# EasyEDA Pro project Lanyard.epro

# Schematic Schematic1
Board Name: Board1; Create Date: 2026-06-07; Page Name: P1; Project Name: lanyard; Schematic Name: Schematic1; Update Date: 2026-06-13; Company: EasyEDA.com; Page Size: A4; Version: V1.0
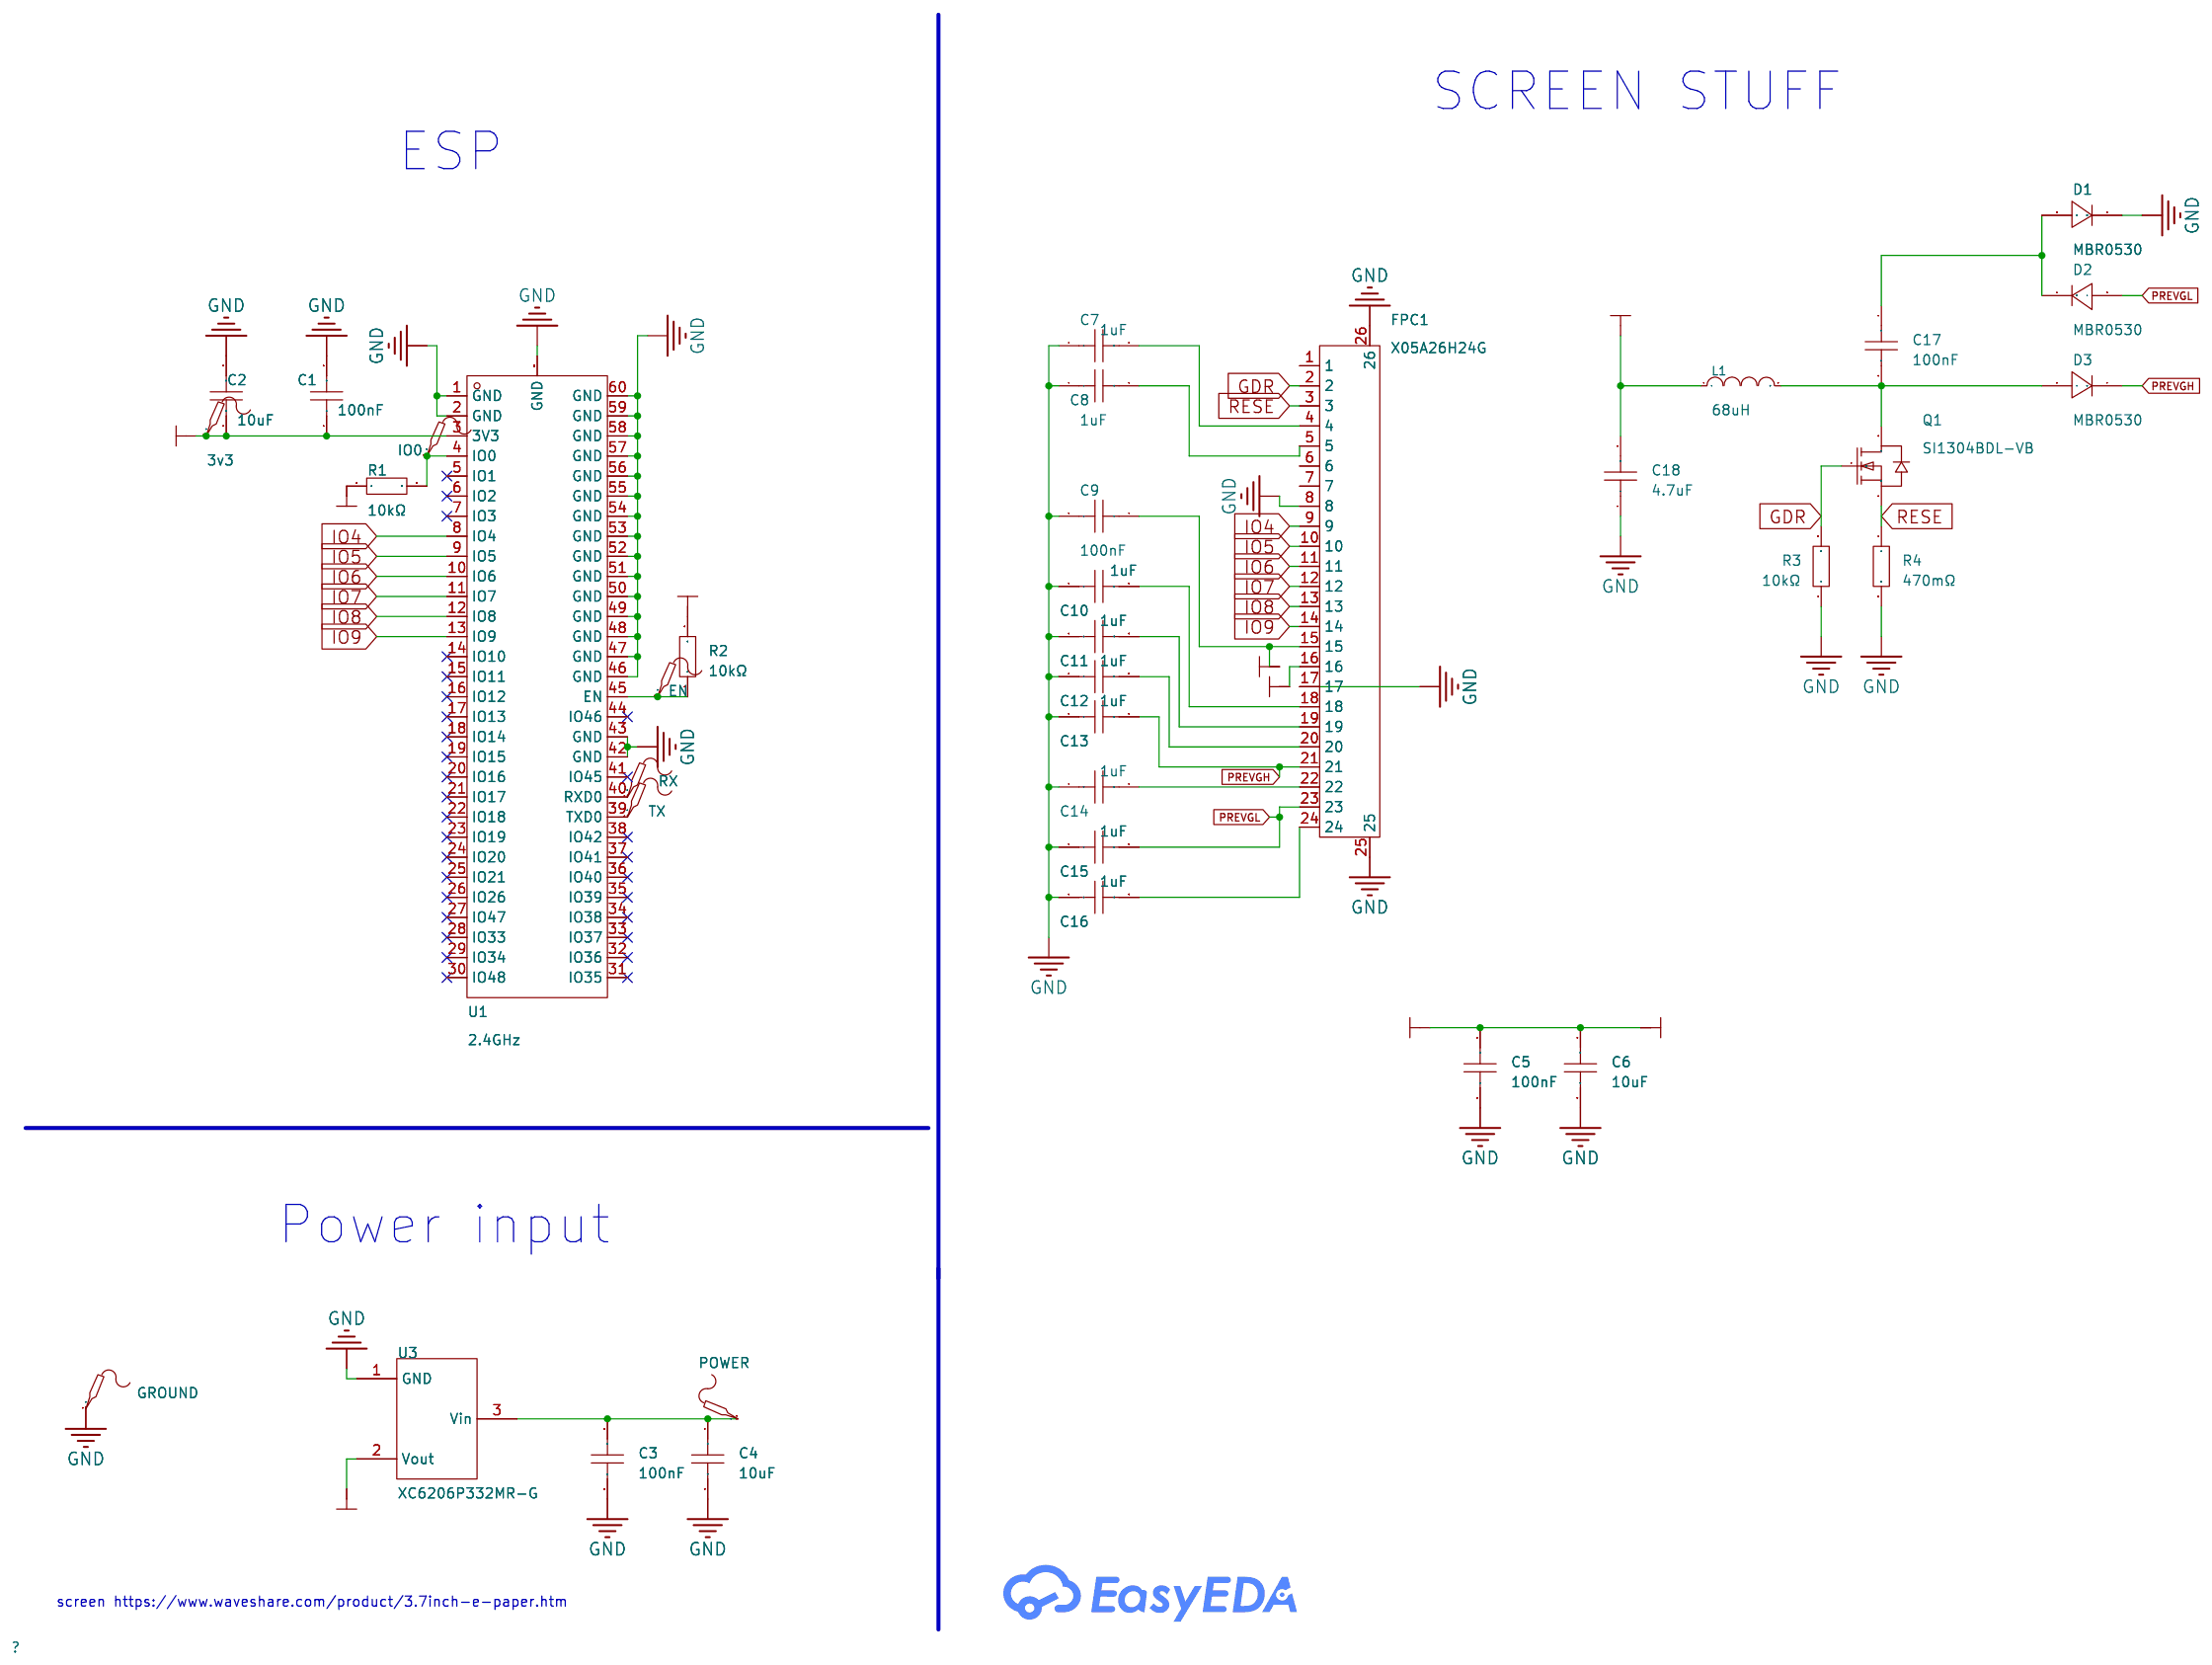
[diagram p0: schematic sheet]

## Parts
3v3  -  [Test-Point-0.5mm]
C1  100nF  [C0603]
C2  10uF  [C0603]
C3  100nF  [C0603]
C4  10uF  [C0603]
C5  100nF  [C0603]
C6  10uF  [C0603]
C7  1uF  [C0603]
C8  1uF  [C0603]
C9  100nF  [C0603]
C10  1uF  [C0603]
C11  1uF  [C0603]
C12  1uF  [C0603]
C13  1uF  [C0603]
C14  1uF  [C0603]
C15  1uF  [C0603]
C16  1uF  [C0603]
C17  100nF  [C0603]
C18  4.7uF  [C0603]
D1  MBR0530  [SOD-123_L2.8-W1.8-LS3.7-RD]
D2  MBR0530  [SOD-123_L2.8-W1.8-LS3.7-RD]
D3  MBR0530  [SOD-123_L2.8-W1.8-LS3.7-RD]
EN  -  [Test-Point-0.5mm]
FPC1  X05A26H24G  [FPC-SMD_X05A26H24G]
GROUND  -  [Test-Point-0.5mm]
IO0  -  [Test-Point-0.5mm]
L1  68uH  [IND-SMD_L3.5-W3.0]
POWER  -  [Test-Point-0.5mm]
Q1  SI1304BDL-VB  [SC-70-3_L2.1-W1.3-P1.30-LS2.1-TL]
R1  10kΩ  [R0603]
R2  10kΩ  [R0603]
R3  10kΩ  [R0603]
R4  470mΩ  [R0603]
RX  -  [Test-Point-0.5mm]
TX  -  [Test-Point-0.5mm]
U1  2.4GHz  [BULETM-SMD_ESP32-S3-MINI-1-N8]
U3  XC6206P332MR-G  [SOT-23-3_L2.9-W1.6-P1.90-LS2.8-BR]

## Library data of the parts
3v3 EN GROUND IO0 POWER RX TX = Test-Point: Test Point 测试点
C1 C3 C5 C9 C17 = CC0603KRX7R9BB104: Capacitance:100nF Tolerance:±10% Tolerance:±10% Voltage Rating:50V Temperature Coefficient:X7R; LCSC Part Name: 100nF ±10% 50V; Supplier Part: C14663; Manufacturer: YAGEO(国巨); Supplier Footprint: 0603; Datasheet: https://item.szlcsc.com/datasheet/CC0603KRX7R9BB104/15331.html; Supplier: LCSC; Tolerance: ±10%; Voltage Rating: 50V; Temperature Coefficient: X7R
C2 C4 C6 = CL10A106KP8NNNC: Capacitance:10uF Tolerance:±10% Tolerance:±10% Voltage Rating:10V Temperature Coefficient:X5R; LCSC Part Name: 10uF ±10% 10V; Supplier Part: C19702; Manufacturer: SAMSUNG(三星); Supplier Footprint: 0603; JLCPCB Part Class: Basic Part; Datasheet: https://item.szlcsc.com/datasheet/CL10A106KP8NNNC/20411.html; Supplier: LCSC; Tolerance: ±10%; Voltage Rating: 10V; Temperature Coefficient: X5R
C7 C8 C10-C16 = GRM188B31H105KAALD: Capacitance:1uF Tolerance:±10% Tolerance:±10% Voltage Rating:50V Temperature Coefficient:-; LCSC Part Name: 1uF ±10% 50V; Supplier Part: C913562; Manufacturer: muRata(村田); Supplier Footprint: 0603; Datasheet: https://item.szlcsc.com/datasheet/GRM188B31H105KAALD/983881.html; Supplier: LCSC; Tolerance: ±10%; Voltage Rating: 50V
C18 = CL10A475KO8NNNC: Capacitance:4.7uF Tolerance:±10% Tolerance:±10% Voltage Rating:16V Temperature Coefficient:X5R; LCSC Part Name: 4.7uF ±10% 16V; Supplier Part: C19666; Manufacturer: SAMSUNG(三星); Supplier Footprint: 0603; Datasheet: https://item.szlcsc.com/datasheet/CL10A475KO8NNNC/20375.html; Supplier: LCSC; Tolerance: ±10%; Voltage Rating: 16V; Temperature Coefficient: X5R
D1-D3 = MBR0530_C77336: Diode Configuration:- Voltage - Forward(Vf@If):550mV@500mA Voltage - DC Reverse(Vr):30V Current - Rectified:500mA Reverse Leakage Current (Ir):80uA@30V Non-Repetitive Peak Forward Surge Current:5.5A; LCSC Part Name: 电压:30V 电流:500mA; Supplier Part: C77336; Manufacturer: CJ(江苏长电/长晶); Supplier Footprint: SOD-123; Datasheet: https://item.szlcsc.com/datasheet/MBR0530/78464.html; Supplier: LCSC; Voltage - Forward(Vf@If): 550mV@500mA; Voltage - DC Reverse(Vr): 30V; Current - Rectified: 500mA; Reverse Leakage Current (Ir): 80uA@30V; Non-Repetitive Peak Forward Surge Current: 5.5A
FPC1 = X05A26H24G: Locking Feature:Hinged Lid Contact Type:Double-Sided Contacts, Top and Bottom Entry Number of Contacts:24P Pitch:0.5mm Mounting Type:Surface Mount, Right Angle FFC, FCB Thickness:0.3mm FFC, FCB Thickness:0.3mm Height Above Board:2.6mm Contact Material:Pho; LCSC Part Name: 间距:0.5mm P数:24P 翻盖式 双侧触点/上下接; Supplier Part: C519265; Manufacturer: XKB Connection(中国星坤); Supplier Footprint: SMD,P=0.5mm,卧贴; Datasheet: https://item.szlcsc.com/datasheet/X05A26H24G/535995.html; Supplier: LCSC; Locking Feature: Hinged Lid; Contact Type: Double-Sided Contacts, Top and Bottom Entry; Number of Contacts: 24P; Pitch: 0.5mm; Mounting Type: Surface Mount, Right Angle; FFC, FCB Thickness: 0.3mm; Height Above Board: 2.6mm; Contact Material: Phosphor Bronze; Contact Plating: Gold; Operating Temperature: -40℃~+85℃
L1 = SM3521-680MT_C72424: Inductance: Tolerance:±20% Tolerance:±20% Rated Current: Saturation Current (Isat):400mA DC Resistance (DCR):; LCSC Part Name: 68uH ±20% 400mA; Supplier Part: C72424; Manufacturer: SXN(顺翔诺); Manufacturer Part: SM3521-680MT; Supplier Footprint: SMD; Datasheet: https://atta.szlcsc.com/upload/public/pdf/source/20210810/DE909F839CF261ABDAA312DFDF4FA1A6.pdf; Supplier: LCSC; Tolerance: ±20%; Saturation Current (Isat): 400mA
Q1 = SI1304BDL-VB: Number:1 N-channel Drain to Source Voltage:20V Current - Continuous Drain(Id):4A RDS(on):36mΩ@10V；40mΩ@4.5V；48mΩ@2.5V Pd - Power Dissipation:2.8W Gate Threshold Voltage (Vgs(th)):1.3V Gate Charge(Qg):4nC Input Capacitance(Ciss):- Reverse Transfer Capacita; LCSC Part Name: 1个N沟道 耐压:20V 电流:4A; Supplier Part: C710060; Manufacturer: VBsemi(微碧半导体); Supplier Footprint: SC-70-3; JLCPCB Part Class: Extended Part; Datasheet: https://item.szlcsc.com/datasheet/SI1304BDL-VB/748018.html; Supplier: LCSC; Number: 1 N-channel; Drain to Source Voltage: 20V; Current - Continuous Drain(Id): 4A; RDS(on): 36mΩ@10V；40mΩ@4.5V；48mΩ@2.5V; Pd - Power Dissipation: 2.8W; Gate Threshold Voltage (Vgs(th)): 1.3V; Gate Charge(Qg): 4nC; Operating Temperature: -55℃~+150℃; Type: N-Channel
R1-R3 = RC0603FR-0710KL: Type:Thick Film Resistor Resistance:10kΩ Tolerance:±1% Tolerance:±1% Power(Watts):100mW Voltage-Supply(Max):75V Temperature Coefficient:±100ppm/℃ Temperature Coefficient:±100ppm/℃ Operating Temperature:-55℃~+155℃ Operating Temperature:-55℃~+155℃; LCSC Part Name: 厚膜电阻 10kΩ ±1% 100mW; Supplier Part: C98220; Manufacturer: YAGEO(国巨); Supplier Footprint: 0603; Datasheet: https://item.szlcsc.com/datasheet/RC0603FR-0710KL/99429.html; Supplier: LCSC; Type: Thick Film Resistor; Tolerance: ±1%; Power(Watts): 100mW; Voltage-Supply(Max): 75V; Temperature Coefficient: ±100ppm/℃; Operating Temperature: -55℃~+155℃
R4 = SR731JTTDR470F: Type:Thick Film Resistor Resistance:470mΩ Tolerance:±1% Tolerance:±1% Power(Watts):250mW Temperature Coefficient:±200ppm/℃ Temperature Coefficient:±200ppm/℃ Operating Temperature:-55℃~+150℃ Operating Temperature:-55℃~+150℃; LCSC Part Name: 厚膜电阻 470mΩ ±1% 250mW; Supplier Part: C186564; Manufacturer: KOA; Supplier Footprint: 0603; JLCPCB Part Class: Extended Part; Datasheet: https://item.szlcsc.com/datasheet/SR731JTTDR470F/197969.html; Supplier: LCSC; Type: Thick Film Resistor; Tolerance: ±1%; Power(Watts): 250mW; Temperature Coefficient: ±200ppm/℃; Operating Temperature: -55℃~+150℃
U1 = ESP32-S3-MINI-1-N4R2: Utilized IC / Part:ESP32-S3 Wireless Standard:Bluetooth5.0 Interface Type:I2C；GPIO；UART；SPI；USB；I2S Frequency:2.4GHz Antenna Type:On-board PCB Antenna Output Power:20.5dBm Output Power:20.5dBm Voltage - Supply:3V~3.6V Voltage - Supply:3V~3.6V Receive  Cur; LCSC Part Name: 不带固件 小尺寸模组，集成2.4GHz Wi-Fi(802.11b/g/n)+Bluetooth 5(LE); Supplier Part: C3013941; Manufacturer: ESPRESSIF(乐鑫); Supplier Footprint: SMD; Datasheet: https://item.szlcsc.com/datasheet/ESP32-S3-MINI-1-N4R2/3522411.html; Supplier: LCSC; Utilized IC / Part: ESP32-S3; Wireless Standard: Bluetooth5.0; Interface Type: I2C；GPIO；UART；SPI；USB；I2S; Antenna Type: On-board PCB Antenna; Output Power: 20.5dBm; Voltage - Supply: 3V~3.6V; Receive  Current: 95mA; Send  Current: 355mA; Sensitivity: -103.5dBm; Operating Temperature: -40℃~+85℃
U3 = XC6206P332MR-G_C5446: Output Configuration:Positive Voltage - Supply:6V Output Voltage:3.3V Output Voltage:3.3V Output Current:200mA Power Supply Rejection Ratio (PSRR):- Voltage Dropout:- standby current:1uA Noise:- Features:Short Circuit Protection；Over Current Protection Op; LCSC Part Name: 3.3V 200mA 6V; Supplier Part: C5446; Manufacturer: TOREX(特瑞仕); Supplier Footprint: SOT-23-3L; Datasheet: https://item.szlcsc.com/datasheet/XC6206P332MR-G/5896.html; Supplier: LCSC; Output Configuration: Positive; Voltage - Supply: 6V; Output Voltage: 3.3V; Output Current: 200mA; standby current: 1uA; Features: Short Circuit Protection；Over Current Protection; Operating Temperature: -40℃~+85℃@(Ta); Output Type: Fixed; Number of Outputs: 1

## Nets
3V3: 3v3.1 C1.1 C2.1 C5.1 C6.1 C9.1 C18.2 FPC1.15 FPC1.16 L1.1 R1.1 R2.2 U1.3(3V3) U3.2(Vout)
GND: C1.2 C2.2 C3.2 C4.2 C5.2 C6.2 C7.1 C8.1 C9.2 C10.1 C11.1 C12.1 C13.1 C14.1 C15.1 C16.1 C18.1 D1.1(C) FPC1.8 FPC1.17 FPC1.25 FPC1.26 GROUND.1 R3.1 R4.2 U1.1(GND) U1.2(GND) U1.42(GND) U1.43(GND) U1.46(GND) U1.47(GND) U1.48(GND) U1.49(GND) U1.50(GND) U1.51(GND) U1.52(GND) U1.53(GND) U1.54(GND) U1.55(GND) U1.56(GND) U1.57(GND) U1.58(GND) U1.59(GND) U1.60(GND) U1.GND U3.1(GND)
GDR: FPC1.2 Q1.1(G) R3.2
IO4: FPC1.9 U1.8(IO4)
IO5: FPC1.10 U1.9(IO5)
IO6: FPC1.11 U1.10(IO6)
IO7: FPC1.12 U1.11(IO7)
IO8: FPC1.13 U1.12(IO8)
IO9: FPC1.14 U1.13(IO9)
PREVGH: C13.2 D3.1(C) FPC1.21
PREVGL: C15.2 D2.2(A) FPC1.23
RESE: FPC1.3 Q1.2(S) R4.1
$1N2460: C3.1 C4.1 POWER.1 U3.3(Vin)
$1N3002: IO0.1 R1.2 U1.4(IO0)
$1N3065: EN.1 R2.1 U1.45(EN)
$1N4616: C8.2 FPC1.5
$1N4620: C7.2 FPC1.4
$1N4913: C10.2 FPC1.18
$1N5156: C11.2 FPC1.19
$1N5162: C12.2 FPC1.20
$1N5246: C14.2 FPC1.22
$1N5326: C16.2 FPC1.24
$1N5661: C17.1 D1.2(A) D2.1(C)
$1N5675: C17.2 D3.2(A) L1.2 Q1.3(D)
$1N8867: RX.1 U1.40(RXD0)
$1N8888: TX.1 U1.39(TXD0)

Not connected (* = marked no-connect by the designer): FPC1 1 6 7; U1 5(IO1)* 6(IO2)* 7(IO3)* 14(IO10)* 15(IO11)* 16(IO12)* 17(IO13)* 18(IO14)* 19(IO15)* 20(IO16)* 21(IO17)* 22(IO18)* 23(IO19)* 24(IO20)* 25(IO21)* 26(IO26)* 27(IO47)* 28(IO33)* 29(IO34)* 30(IO48)* 31(IO35)* 32(IO36)* 33(IO37)* 34(IO38)* 35(IO39)* 36(IO40)* 37(IO41)* 38(IO42)* 41(IO45)* 44(IO46)*

## Notes on the sheet
- SCREEN STUFF
- ESP
- Power input
- screen https://www.waveshare.com/product/3.7inch-e-paper.htm

# Board PCB1
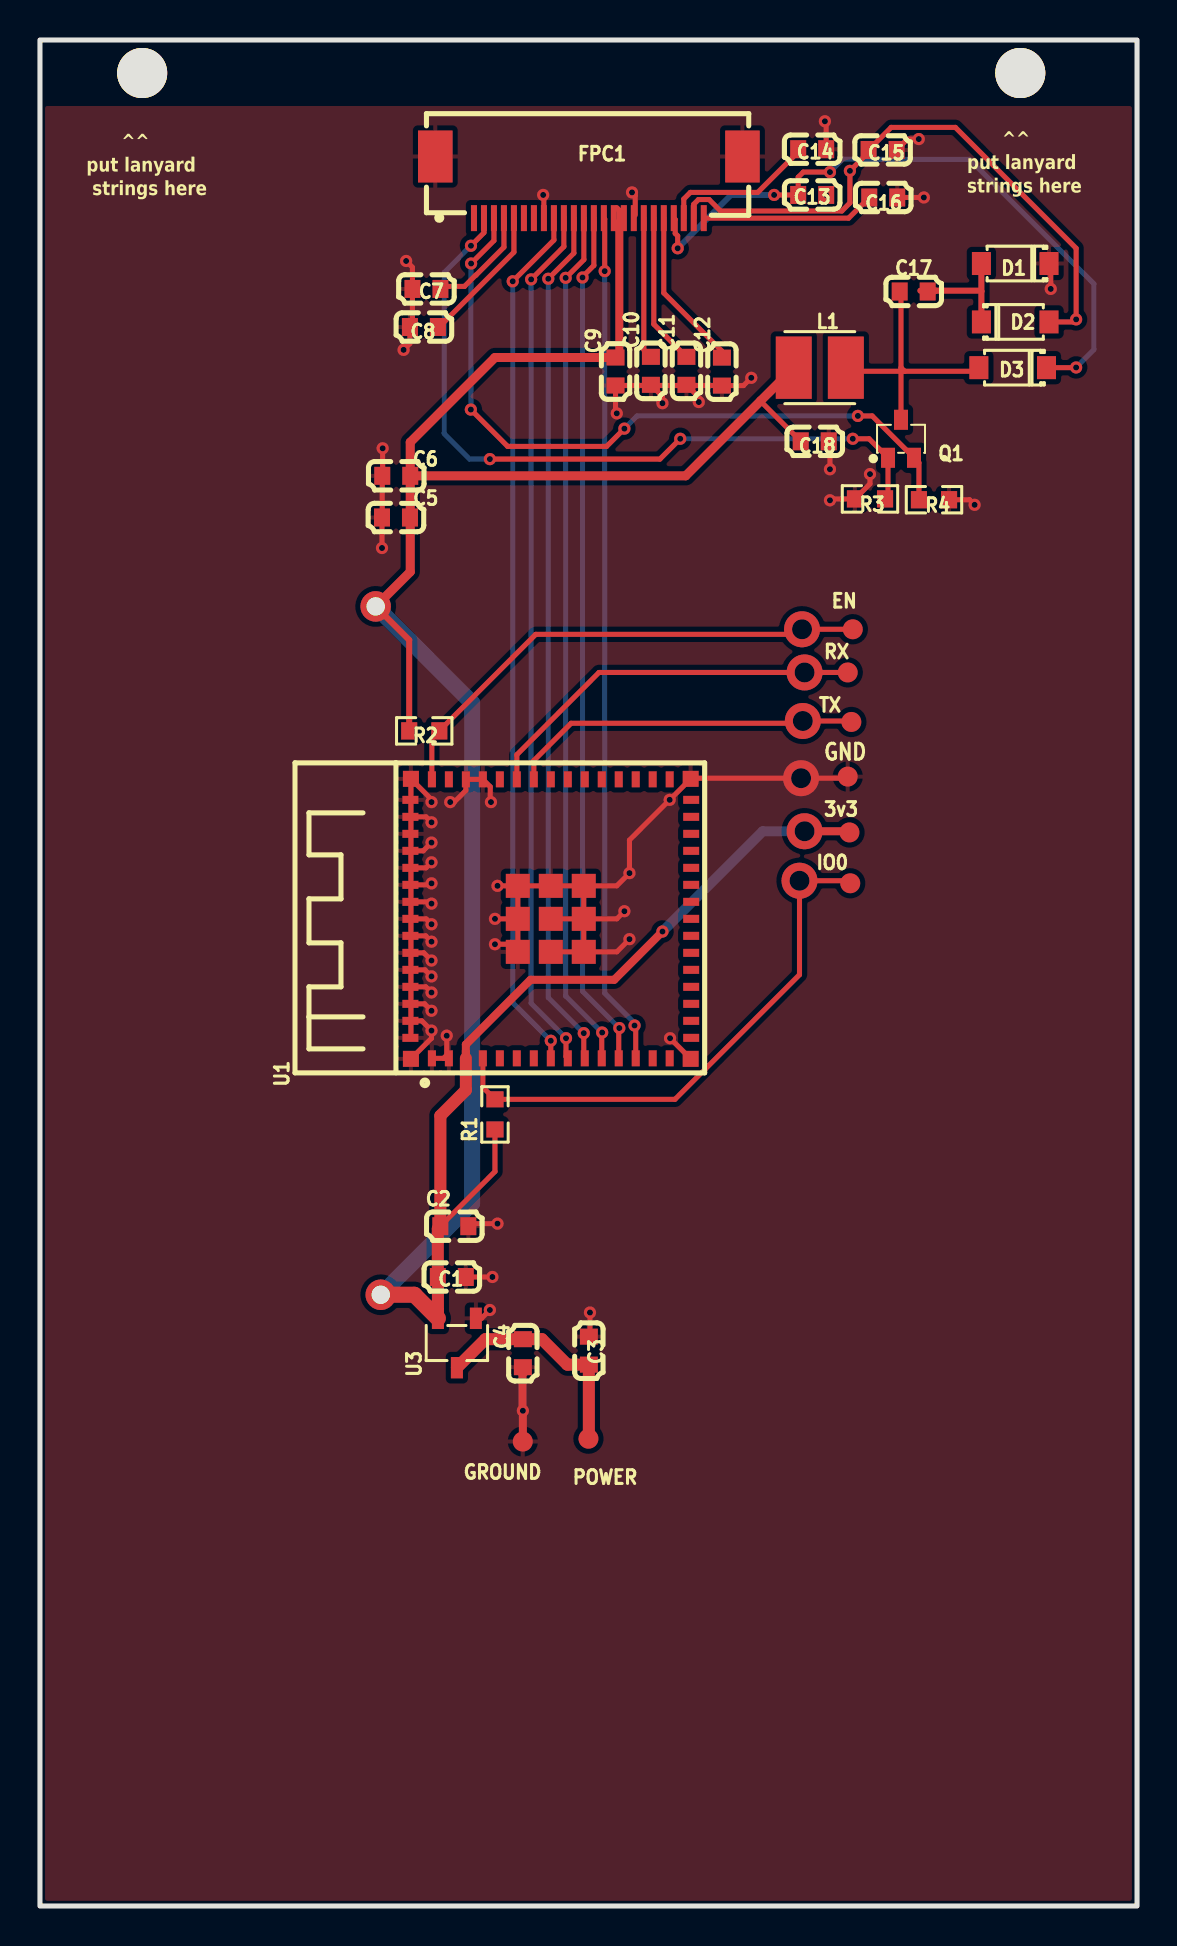
[diagram p1: board, top side]
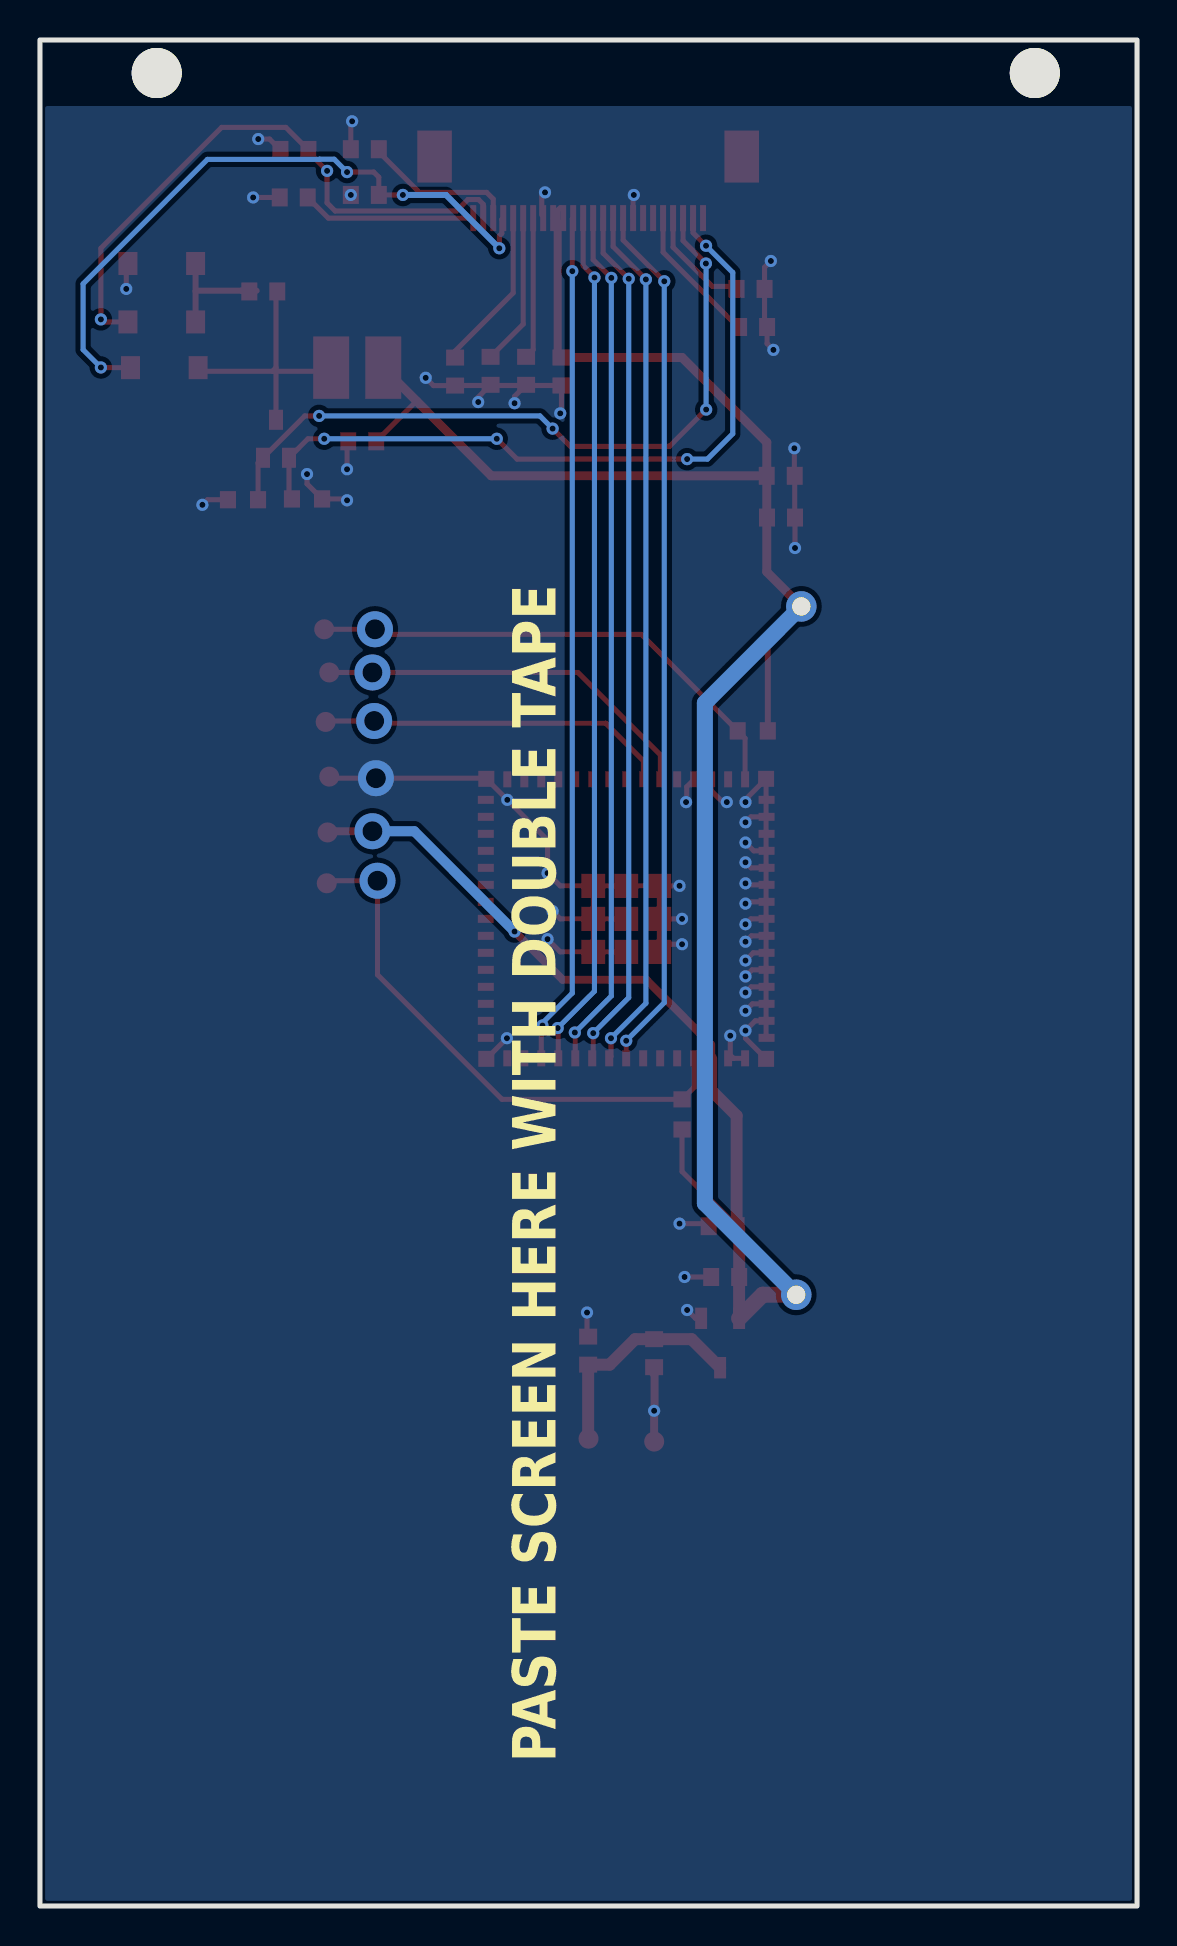
[diagram p2: board, bottom side, seen from below]

Outline 54.9 x 93.3 mm; copper layers: Top Layer, Bottom Layer. Coordinates in mm from the lower left corner of the outline.
Outline path: rectangle 0,93.3 54.9,0
Stack: Top Layer 0.035mm / Dielectric1 1.51mm FR4 er 4.5 / Bottom Layer 0.035mm

## Design rules (mm)
template: JLCPCB Capability(Two Layers Board)
spacing copperThickness1oz (default): track to track 0.102, other pairs 0.152 to 0.3
spacing copperThickness2oz: track to track 0.203, other pairs 0.152 to 0.3
track width copperThickness1oz (default): min 0.127, default 0.254, max 2.54
track width copperThickness2oz: min 0.203, default 0.254, max 2.54
differential pair differentialPair (default): width min 0.127, default 0.254, max 2.54; gap min 0.152, default 0.152
via viaSize (default): diameter min 0.5, default 0.61, max 10; hole min 0.3, default 0.305, max 6.3

## Placement (name value [footprint] x y rotation side)
3v3  -  [Test-Point-0.5mm]  40.51 53.68 0 top
C1  100nF  [C0603]  20.61 31.45 0 top
C2  10uF  [C0603]  20.74 33.99 0 top
C3  100nF  [C0603]  27.47 27.77 90 top
C4  10uF  [C0603]  24.17 27.64 270 top
C5  100nF  [C0603]  17.82 69.42 180 top
C6  10uF  [C0603]  17.83 71.51 180 top
C7  1uF  [C0603]  19.34 80.85 0 top
C8  1uF  [C0603]  19.21 78.95 0 top
C9  100nF  [C0603]  28.8 76.72 270 top
C10  1uF  [C0603]  30.57 76.76 90 top
C11  1uF  [C0603]  32.35 76.76 90 top
C12  1uF  [C0603]  34.13 76.72 90 top
C13  1uF  [C0603]  38.64 85.55 180 top
C14  1uF  [C0603]  38.64 87.84 180 top
C15  1uF  [C0603]  42.17 87.8 180 top
C16  1uF  [C0603]  42.2 85.43 180 top
C17  100nF  [C0603]  43.72 80.73 180 top
C18  4.7uF  [C0603]  38.77 73.23 180 top
D1  MBR0530  [SOD-123_L2.8-W1.8-LS3.7-RD]  48.8 82.12 180 top
D2  MBR0530  [SOD-123_L2.8-W1.8-LS3.7-RD]  48.8 79.2 0 top
D3  MBR0530  [SOD-123_L2.8-W1.8-LS3.7-RD]  48.68 76.92 180 top
EN  -  [Test-Point-0.5mm]  40.68 63.84 0 top
FPC1  X05A26H24G  [FPC-SMD_X05A26H24G]  27.47 85.93 180 top
GROUND  -  [Test-Point-0.5mm]  24.16 23.22 0 top
IO0  -  [Test-Point-0.5mm]  40.55 51.14 0 top
L1  68uH  [IND-SMD_L3.5-W3.0]  39.02 76.92 180 top
NOREF  -  [Pad_e711]  5.12 91.65 0 top
NOREF#2  -  [Pad_e718]  49.06 91.65 0 top
NOREF#3  -  [Pad_e677]  16.8 64.98 0 top
NOREF#4  -  [Pad_e296]  40.42 56.47 0 top
NOREF#5  -  [Pad_e672]  17.05 30.56 0 top
POWER  -  [Test-Point-0.5mm]  27.45 23.36 0 top
Q1  SI1304BDL-VB  [SC-70-3_L2.1-W1.3-P1.30-LS2.1-TL]  43.09 73.36 90 top
R1  10kΩ  [R0603]  22.77 39.58 90 top
R2  10kΩ  [R0603]  19.23 58.76 180 top
R3  10kΩ  [R0603]  41.54 70.35 0 top
R4  470mΩ  [R0603]  44.74 70.31 0 top
RX  -  [Test-Point-0.5mm]  40.42 61.68 0 top
TX  -  [Test-Point-0.5mm]  40.6 59.2 0 top
U1  2.4GHz  [BULETM-SMD_ESP32-S3-MINI-1-N8]  25.56 49.36 90 top
U3  XC6206P332MR-G  [SOT-23-3_L2.9-W1.6-P1.90-LS2.8-BR]  20.86 28.15 90 top

## Footprints (pads in the part's own frame, mm; a bottom-side part is the same pattern mirrored in y, then rotated)
BULETM-SMD_ESP32-S3-MINI-1-N8
  rect 0.8x0.4 smd: 1(-6.975,5.95) 2(-6.975,5.1) 3(-6.975,4.25) 4(-6.975,3.4) 5(-6.975,2.55) 6(-6.975,1.7) 7(-6.975,0.85) 8(-6.975,0) 9(-6.975,-0.85) 10(-6.975,-1.7) 11(-6.975,-2.55) 12(-6.975,-3.4) 13(-6.975,-4.25) 14(-6.975,-5.1) 15(-6.975,-5.95) 31(6.975,-5.95) 32(6.975,-5.1) 33(6.975,-4.25) 34(6.975,-3.4) 35(6.975,-2.55) 36(6.975,-1.7) 37(6.975,-0.85) 38(6.975,0) 39(6.975,0.85) 40(6.975,1.7) 41(6.975,2.55) 42(6.975,3.4) 43(6.975,4.25) 44(6.975,5.1) 45(6.975,5.95)
  rect 0.4x0.8 smd: 16(-5.95,-7.025) 17(-5.1,-7.025) 18(-4.25,-7.025) 19(-3.4,-7.025) 20(-2.55,-7.025) 21(-1.7,-7.025) 22(-0.85,-7.025) 23(0,-7.025) 24(0.85,-7.025) 25(1.7,-7.025) 26(2.55,-7.025) 27(3.4,-7.025) 28(4.25,-7.025) 29(5.1,-7.025) 30(5.95,-7.025) 46(5.95,7.025) 47(5.1,7.025) 48(4.25,7.025) 49(3.4,7.025) 50(2.55,7.025) 51(1.7,7.025) 52(0.85,7.025) 53(0,7.025) 54(-0.85,7.025) 55(-1.7,7.025) 56(-2.55,7.025) 57(-3.4,7.025) 58(-4.25,7.025) 59(-5.1,7.025) 60(-5.95,7.025)
  rect 0.8x0.8 smd: GND(-7,7) GND(-7,-7) GND(7,7) GND(7,-7)
  rect 1.2x1.2 smd: GND(-1.65,1.65) GND(-1.65,0) GND(-1.65,-1.65) GND(0,1.65) GND(0,0) GND(0,-1.65) GND(1.65,1.65) GND(1.65,0) GND(1.65,-1.65)
C0603
  rect 0.8x0.9 smd: 1(-0.7,0) 2(0.7,0)
FPC-SMD_X05A26H24G
  rect 0.3x1.3 smd: 1(5.75,1.54) 2(5.25,1.54) 3(4.75,1.54) 4(4.25,1.54) 5(3.75,1.54) 6(3.25,1.54) 7(2.75,1.54) 8(2.25,1.54) 9(1.75,1.54) 10(1.25,1.54) 11(0.75,1.54) 12(0.25,1.54) 13(-0.25,1.54) 14(-0.75,1.54) 15(-1.25,1.54) 16(-1.75,1.54) 17(-2.25,1.54) 18(-2.75,1.54) 19(-3.25,1.54) 20(-3.75,1.54) 21(-4.25,1.54) 22(-4.75,1.54) 23(-5.25,1.54) 24(-5.75,1.54)
  rect 1.73x2.6 smd: 25(-7.685,-1.54) 26(7.685,-1.54)
IND-SMD_L3.5-W3.0
  rect 1.8x3.12 smd: 1(1.303,0) 2(-1.303,0)
Pad_e296
  round 1 smd: TP1(0,0)
Pad_e672
  round 1.524 hole 0.914: 1(0,0)
Pad_e677
  round 1.524 hole 0.914: 1(0,0)
Pad_e711
  round 2.5 hole 2.5: 1(0,0)
Pad_e718
  round 2.5 hole 2.5: 1(0,0)
R0603
  rect 0.806x0.864 smd: 1(-0.753,0) 2(0.753,0)
SC-70-3_L2.1-W1.3-P1.30-LS2.1-TL
  rect 1x0.7 smd: 1(-0.95,0.65) 2(-0.95,-0.65) 3(0.95,0)
SOD-123_L2.8-W1.8-LS3.7-RD
  rect 0.95x1.15 smd: 1(-1.692,0) 2(1.692,0)
SOT-23-3_L2.9-W1.6-P1.90-LS2.8-BR
  rect 1.07x0.6 smd: 1(1.235,-0.95) 2(1.235,0.95) 3(-1.235,0)
Test-Point-0.5mm
  round 1 smd: 1(0,0)

## Nets
As in the schematic, except:
3V3: 3v3.1 C1.1 C2.1 C5.1 C6.1 C9.1 C18.2 FPC1.15 FPC1.16 L1.1 NOREF#3.1 NOREF#5.1 R1.1 R2.2 U1.3 U3.2
GND: C1.2 C2.2 C3.2 C4.2 C5.2 C6.2 C7.1 C8.1 C9.2 C10.1 C11.1 C12.1 C13.1 C14.1 C15.1 C16.1 C18.1 D1.1 FPC1.8 FPC1.17 FPC1.25 FPC1.26 GROUND.1 NOREF#4.TP1 R3.1 R4.2 U1.1 U1.2 U1.42 U1.43 U1.46 U1.47 U1.48 U1.49 U1.50 U1.51 U1.52 U1.53 U1.54 U1.55 U1.56 U1.57 U1.58 U1.59 U1.60 U1.GND U3.1

Pads without a net: FPC1 1 6 7; NOREF 1; NOREF#2 1; U1 5 6 7 14 15 16 17 18 19 20 21 22 23 24 25 26 27 28 29 30 31 32 33 34 35 36 37 38 41 44

## Via types
v1: diameter 0.61, hole 0.305, Top Layer to Bottom Layer, 75 vias
v2: diameter 1.8, hole 1, Top Layer to Bottom Layer, 6 vias

## Routing (per net, layer and track width the routed paths; a pad name or vN(x,y) marks a point on that pad's centre or on a via; arc(x,y) is an arc through that point)
3V3: length 145.8
  Top Layer w0.254: 28.86,84.92 28.99,84.79 28.99,84.17 FPC1.16 ; R1.1 22.77,36.72 C2.1 ; C18.2 36.06,75.25 36.06,75.25
  Top Layer w0.3: R2.2 18.48,63.3 NOREF#3.1
  Top Layer w0.4: v1(31.15,48.72) 28.74,46.31 24.55,46.31 21.31,43.08 U1.3 ; C9.1 28.99,77.61 28.99,84.17 ; 38.14,53.74 40.45,53.74 3v3.1
  Top Layer w0.45: C6.1 32.32,71.51 L1.1 ; C6.1 18.53,66.71 NOREF#3.1 ; C6.1 18.53,73.19 22.77,77.42 C9.1
  Top Layer w0.6: U1.3 21.31,40.79 20.04,39.51 C2.1 19.91,33.86 C1.1 19.91,31.45 U3.2
  Top Layer w0.8: U3.2 18.74,30.56 NOREF#5.1
  Bottom Layer w0.5: v1(31.15,48.72) 36.17,53.74 v2(38.26,53.74)
  Bottom Layer w0.8: NOREF#5.1 21.63,35.13 21.63,60.15 NOREF#3.1
GND: length 118
  Top Layer w0.254: 32.38,76.02 32.97,75.44 v1(32.97,75.2) ; 32.38,76.02 30.61,76.02 ; 32.38,76.02 34.12,76.02 C12.1 35.21,76.02 v1(35.6,76.41) ; 32.38,76.02 C11.1 ; v1(18.2,77.81) 18.51,78.12 C8.1 18.64,79.08 C7.1 18.64,81.93 v1(18.32,82.25) ; U1.GND 28.87,47.71 v1(29.5,48.34) ; U1.GND U1.GND ; U1.GND U1.GND ; v1(19.59,45.67) 19.31,45.96 18.56,45.96 ; U1.GND U1.GND ; U1.GND 28.86,51.01 v1(29.5,51.64) 29.5,53.3 v1(31.51,55.31) U1.GND 32.6,56.39 v2(38.09,56.39) 40.34,56.39 NOREF#4.TP1 ; U1.GND U1.GND U1.GND ; U1.GND 28.86,49.36 v1(29.25,49.74) ; U1.GND U1.GND ; v1(19.59,49.09) 19.32,49.36 18.56,49.36 ; v1(20.36,43.52) 20.36,42.54 20.2,42.38 ; U3.1 22.1,29.38 v1(22.52,29.8) ; v1(39.53,71.84) 39.53,73.17 C18.1 ; v1(20.53,55.2) 20.73,55.2 21.31,55.78 U1.43 U1.42 22.53,55.96 22.53,55.2 v1(22.57,55.2) ; 18.56,49.36 18.56,48.51 ; 18.56,49.36 U1.53 ; 18.56,49.36 18.56,50.21 ; 18.56,48.51 19.3,48.51 v1(19.59,48.21) ; 18.56,48.51 U1.54 ; 18.56,48.51 18.56,47.66 ; 30.61,76.02 31.15,75.48 v1(31.15,75.14) ; 30.61,76.02 C9.2 28.8,74.69 v1(28.86,74.63) ; 30.61,76.02 C10.1 ; 18.56,50.21 19.51,50.21 v1(19.59,50.12) ; 18.56,50.21 U1.52 ; 18.56,50.21 18.56,51.06 ; v1(39.53,70.28) 39.6,70.35 R3.1 41.54,71.11 v1(41.54,71.6) ; C15.1 43.41,88.35 v1(43.98,88.35) ; v1(46.77,70.06) 46.52,70.31 R4.2 ; U1.GND U1.GND ; U1.GND v1(22.9,51.01) ; v1(22.77,48.09) 23.53,48.09 U1.GND U1.GND ; v1(19.59,55.2) 19.59,55.33 U1.GND 18.56,55.31 ; 27.47,28.47 27.52,28.52 v1(27.52,29.67) ; v1(39.28,89.24) 39.34,89.17 C14.1 ; 18.56,45.11 19.25,45.11 v1(19.59,44.76) ; 18.56,45.11 18.56,44.26 ; 18.56,45.11 18.56,45.96 ; 18.56,45.11 U1.58 ; v1(17.12,67.9) C5.2 17.13,69.44 C6.2 17.15,71.53 v1(17.15,72.88) ; 18.54,54.46 18.56,54.46 ; 18.56,54.46 19.32,54.46 v1(19.59,54.18) ; 18.56,54.46 18.56,55.31 ; 18.56,54.46 18.56,52.76 ; 18.56,46.81 19.27,46.81 v1(19.59,46.48) ; 18.56,46.81 18.56,45.96 ; 18.56,46.81 U1.56 ; 18.56,46.81 18.56,47.66 ; v1(29.63,85.68) 29.79,85.52 29.79,84.55 ; U1.49 18.56,52.76 ; 18.56,52.76 19.18,52.76 v1(19.59,53.17) ; 18.56,52.76 18.56,51.91 ; v1(22.64,31.45) C1.2 ; 18.56,44.26 U1.59 ; 18.56,44.26 18.56,43.41 ; 18.56,44.26 19.11,44.26 v1(19.59,43.77) 19.59,43.39 U1.GND ; v1(25.18,85.55) 25.22,85.52 FPC1.8 ; U1.GND v1(22.77,49.36) ; 18.56,51.91 19.32,51.91 v1(19.59,52.18) ; 18.56,51.91 U1.50 ; 18.56,51.91 18.56,51.06 ; 18.56,45.96 18.54,45.96 ; C2.2 21.56,34.12 v1(22.9,34.12) ; 18.56,55.31 U1.46 ; U1.51 18.56,51.06 ; 18.56,51.06 19.52,51.06 v1(19.59,51.13) ; 20.2,42.38 U1.2 ; 20.2,42.38 U1.1 ; D1.1 50.58,82.04 v1(50.58,80.85) ; U1.GND v1(31.53,43.39) ; C16.1 v1(44.23,85.43) ; 18.56,47.66 19.21,47.66 v1(19.59,47.27) ; 18.56,47.66 18.54,47.66
  Top Layer w0.4: 24.29,23.22 24.17,23.34 v1(24.17,24.76) 24.15,24.78 24.15,26.58 24.29,26.73
  vias: v1(39.34,85.55)
GDR: length 37.3
  Top Layer w0.254: v1(22.52,72.34) 31.02,72.34 v1(32.04,73.36) ; v1(40.68,73.36) 41.49,73.36 Q1.1 42.44,70.5 R3.2 ; v1(21.57,83.01) 22.22,83.66 FPC1.2
  Bottom Layer w0.254: v1(21.57,83.01) 20.23,81.67 20.23,73.61 21.5,72.34 v1(22.52,72.34) ; v1(32.04,73.36) v1(40.68,73.36)
IO4: length 43.7
  Top Layer w0.254: U1.8 v1(25.56,43.26) ; v1(23.66,81.23) 25.72,83.3 FPC1.9
  Bottom Layer w0.254: v1(25.56,43.26) 23.66,45.17 v1(23.66,81.23)
IO5: length 43.4
  Top Layer w0.254: U1.9 26.33,42.47 v1(26.33,43.39) ; FPC1.10 26.22,82.97 v1(24.58,81.33)
  Bottom Layer w0.254: v1(24.58,81.33) 24.58,45.13 v1(26.33,43.39)
IO6: length 43.3
  Top Layer w0.254: FPC1.11 26.72,82.64 v1(25.44,81.36) ; U1.10 27.21,42.43 v1(27.21,43.64)
  Bottom Layer w0.254: v1(27.21,43.64) 25.44,45.42 v1(25.44,81.36)
IO7: length 43.2
  Top Layer w0.254: v1(28.13,43.67) 28.11,43.65 U1.11 ; v1(26.31,81.41) 27.22,82.32 FPC1.12
  Bottom Layer w0.254: v1(28.13,43.67) 26.31,45.5 v1(26.31,81.41)
IO8: length 43
  Top Layer w0.254: FPC1.13 27.72,82.03 27.15,81.46 v1(27.15,81.42) ; v1(28.99,43.9) 28.96,43.87 U1.12
  Bottom Layer w0.254: v1(28.99,43.9) 27.15,45.74 v1(27.15,81.42)
IO9: length 42.5
  Top Layer w0.254: v1(28.26,81.74) 28.26,84.35 FPC1.14 ; v1(29.75,44.02) 29.81,43.96 U1.13
  Bottom Layer w0.254: 29.75,44.15 28.26,45.64 v1(28.26,81.74)
PREVGH: length 33.3
  Top Layer w0.254: FPC1.21 31.79,84.32 31.79,83.63 31.91,83.5 v1(31.91,82.89) ; v1(39.53,86.7) 38.2,86.7 37.94,86.44 C13.2 36.87,85.55 ; D3.1 51.84,76.92 v1(51.85,76.93)
  Bottom Layer w0.254: v1(39.53,86.7) 40.18,87.34 40.9,87.34 40.91,87.33 46.52,87.33 52.74,81.11 52.74,77.82 v1(51.85,76.93)
  Bottom Layer w0.3: v1(31.91,82.89) 34.58,85.55 v1(36.74,85.55)
PREVGL: length 30.4
  Top Layer w0.254: D2.2 51.73,79.2 v1(51.85,79.33) 51.85,82.89 45.81,88.93 42.6,88.93 C15.2 41.47,87.69 v1(40.53,86.76) 40.53,85.16 40.13,84.75 34.06,84.75 33.48,85.32 32.95,85.32 32.72,85.09 FPC1.23
RESE: length 36.7
  Top Layer w0.254: R4.1 43.99,72.16 Q1.2 41.65,74.5 v1(40.93,74.5) ; v1(21.56,74.82) 23.4,72.98 28.36,72.98 v1(29.25,73.87) ; FPC1.3 22.72,83.27 v1(21.58,82.12)
  Bottom Layer w0.254: v1(29.25,73.87) 29.88,74.5 v1(40.93,74.5) ; v1(21.56,74.82) 21.56,82.11 v1(21.58,82.12)
$1N2460: length 11.4
  Top Layer w0.6: POWER.1 27.47,23.36 27.47,27.07 26.39,27.07 25.12,28.34 C4.1 22.29,28.34 U3.3
$1N3002: length 27.4
  Top Layer w0.254: IO0.1 40.42,51.26 v2(38.01,51.26) 38.01,46.56 31.78,40.33 R1.2 22.16,40.94 U1.4
$1N3065: length 25
  Top Layer w0.254: 40.3,63.84 v2(38.14,63.84) 37.88,63.58 24.81,63.58 R2.1 19.61,58.39 U1.45
$1N4616: length 7.1
  Top Layer w0.254: FPC1.5 23.72,82.69 19.98,78.95 C8.2
$1N4620: length 5.5
  Top Layer w0.254: C7.2 20.17,80.98 21.24,80.98 21.8,81.54 21.82,81.54 23.22,82.94 FPC1.4
$1N4913: length 7.1
  Top Layer w0.254: C10.2 30.22,77.81 FPC1.18
$1N5156: length 7.6
  Top Layer w0.254: C11.2 30.72,79.09 FPC1.19
$1N5162: length 8.2
  Top Layer w0.254: FPC1.20 31.22,80.65 34.13,77.74 C12.2
$1N5246: length 7.8
  Top Layer w0.254: FPC1.22 32.22,85.35 32.55,85.68 35.92,85.68 37.94,87.71 C14.2
$1N5326: length 8.7
  Top Layer w0.254: C16.2 40.47,84.39 FPC1.24
$1N5661: length 6.1
  Top Layer w0.3: D1.2 47.11,80.74 ; 47.11,80.74 D2.1 ; 47.11,80.74 47.09,80.77 44.82,80.77 ; 44.54,80.74 44.53,80.73 C17.1 ; 44.82,80.77 44.06,80.77 ; 44.82,80.77 44.79,80.74
$1N5675: length 13.6
  Top Layer w0.254: 43.27,76.74 46.8,76.74 D3.2 ; 43.27,76.74 43.09,76.74 ; 43.27,76.74 43.09,76.92 ; C17.2 43.09,80.66 43.09,76.92 ; 43.09,76.74 Q1.3 ; 43.09,76.74 43.09,76.92 ; 43.09,76.74 40.4,76.74 40.33,76.81 L1.2
$1N8867: length 19.5
  Top Layer w0.254: RX.1 v2(38.26,61.68) 27.98,61.68 23.86,57.56 U1.40
$1N8888: length 17.7
  Top Layer w0.254: TX.1 40.56,59.25 v2(38.18,59.25) 38.06,59.14 26.58,59.14 24.71,57.27 U1.39

## Copper pours and planes (outline as drawn; the poured copper is in the pictures)
GND on Top Layer: 0.16,90 54.9,90 54.9,0 0.16,0
GND on Bottom Layer: 0.16,90 54.9,90 54.9,0 0.16,0

## Text on the board
Bottom Silkscreen Layer: PASTE SCREEN HERE WITH DOUBLE TAPE
Top Silkscreen Layer: GND | ^^ / put lanyard / strings here
